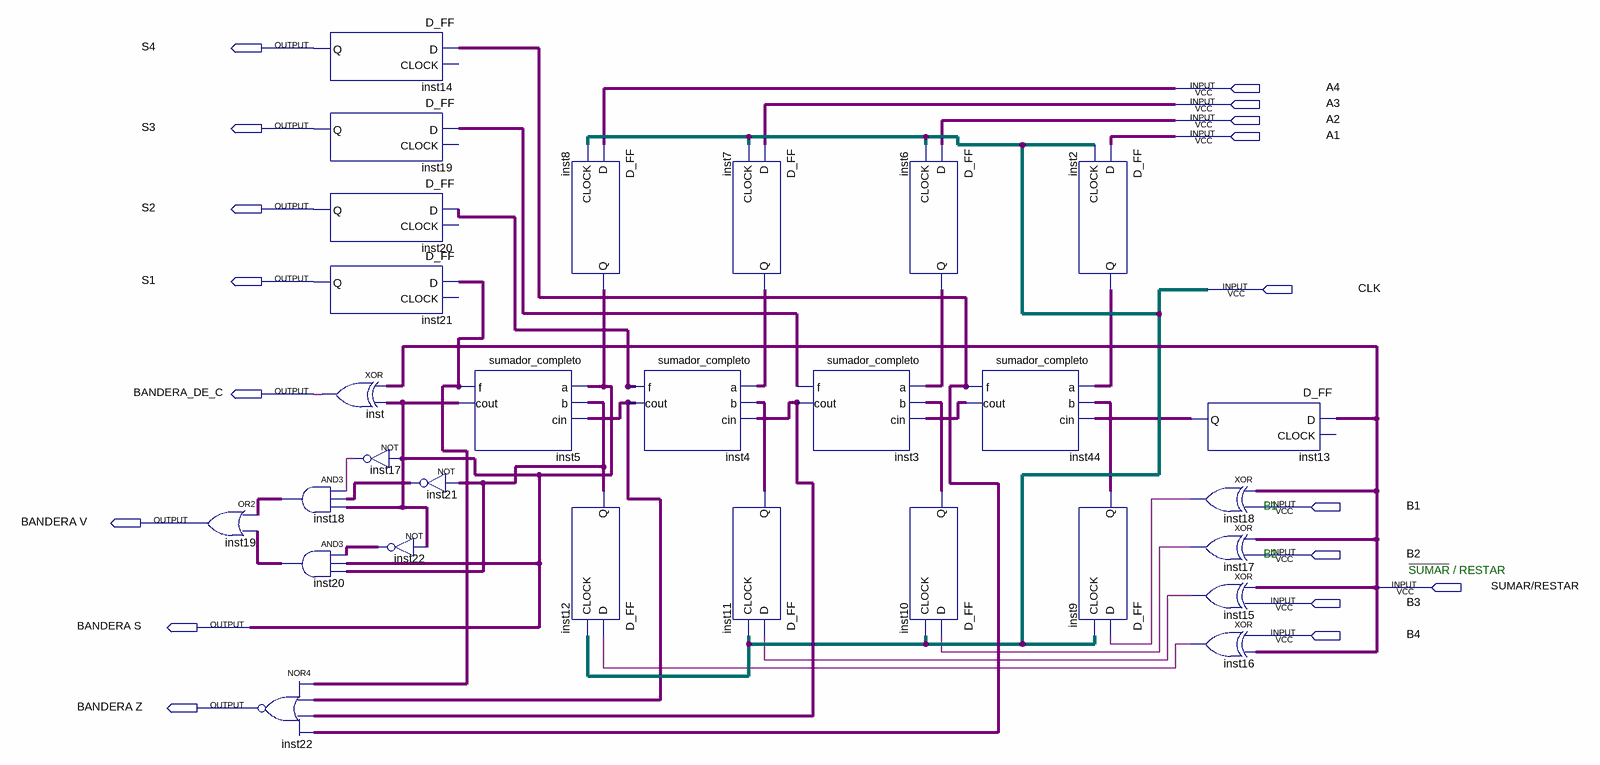
[diagram p0: schematic sheet]
// Quartus schematic sumador_restador_completo.bdf as structural Verilog: 29 symbols, 18 pins
module sumador_restador_completo (
  input  A4,
  input  A3,
  input  A2,
  input  A1,
  input  CLK,
  input  B1,
  input  B2,
  input  \SUMAR/RESTAR ,
  input  B3,
  input  B4,
  output S4,
  output S3,
  output S2,
  output S1,
  output BANDERA_DE_C,
  output \BANDERA_V ,
  output \BANDERA_S ,
  output \BANDERA_Z 
);

  wire inst2_q, inst3_cout, inst3_f, inst4_cout, inst4_f, inst5_f, inst6_q, inst7_q, inst9_q, inst10_q,
       inst11_q, inst12_q, inst13_q, inst15_out, inst16_out, inst17_out, inst17_out_2, inst18_out,
       inst18_out_2, inst20_out, inst21_out, inst22_out, inst44_cout, inst44_f;

  or inst19 (\BANDERA_V , inst18_out_2, inst20_out);
  and inst18 (inst18_out_2, inst17_out_2, inst21_out, \BANDERA_S );
  and inst20 (inst20_out, inst22_out, \BANDERA_S , inst12_q);
  nor inst22 (\BANDERA_Z , inst5_f, inst4_cout, inst3_cout, inst44_f);
  D_FF inst14 (.D(inst44_f), .Q(S4));  // open: CLOCK
  D_FF inst19_dup2 (.D(inst3_f), .Q(S3));  // open: CLOCK
  D_FF inst20_dup2 (.D(inst4_f), .Q(S2));  // open: CLOCK
  D_FF inst21 (.D(inst5_f), .Q(S1));  // open: CLOCK
  xor inst (BANDERA_DE_C, \SUMAR/RESTAR , \BANDERA_S );
  not inst17 (inst17_out_2, \BANDERA_S );
  not inst21_dup2 (inst21_out, inst12_q);
  not inst22_dup2 (inst22_out, \BANDERA_S );
  sumador_completo inst5 (.a(\BANDERA_S ), .b(inst12_q), .cin(inst4_cout), .f(inst5_f), .cout(\BANDERA_S ));
  D_FF inst8 (.D(A4), .Q(\BANDERA_S ));  // open: CLOCK
  D_FF inst12 (.D(inst16_out), .Q(inst12_q));  // open: CLOCK
  sumador_completo inst4 (.a(inst7_q), .b(inst11_q), .cin(inst3_cout), .f(inst4_f), .cout(inst4_cout));
  D_FF inst7 (.D(A3), .Q(inst7_q));  // open: CLOCK
  D_FF inst11 (.D(inst15_out), .Q(inst11_q));  // open: CLOCK
  sumador_completo inst3 (.a(inst6_q), .b(inst10_q), .cin(inst44_cout), .f(inst3_f), .cout(inst3_cout));
  D_FF inst6 (.D(A2), .Q(inst6_q));  // open: CLOCK
  D_FF inst10 (.D(inst17_out), .Q(inst10_q));  // open: CLOCK
  sumador_completo inst44 (.a(inst2_q), .b(inst9_q), .cin(inst13_q), .f(inst44_f), .cout(inst44_cout));
  D_FF inst2 (.D(A1), .Q(inst2_q));  // open: CLOCK
  D_FF inst9 (.D(inst18_out), .Q(inst9_q));  // open: CLOCK
  D_FF inst13 (.D(\SUMAR/RESTAR ), .Q(inst13_q));  // open: CLOCK
  xor inst18_dup2 (inst18_out, \SUMAR/RESTAR , B1);
  xor inst17_dup2 (inst17_out, \SUMAR/RESTAR , B2);
  xor inst15 (inst15_out, \SUMAR/RESTAR , B3);
  xor inst16 (inst16_out, B4, \SUMAR/RESTAR );

  // Notes on the sheet:
  //   B1
  //   B2
  //   SUMAR / RESTAR
endmodule
